# Altium schematic sheet FEV-60_Motor_Driver_Mcu.SchDoc
size B
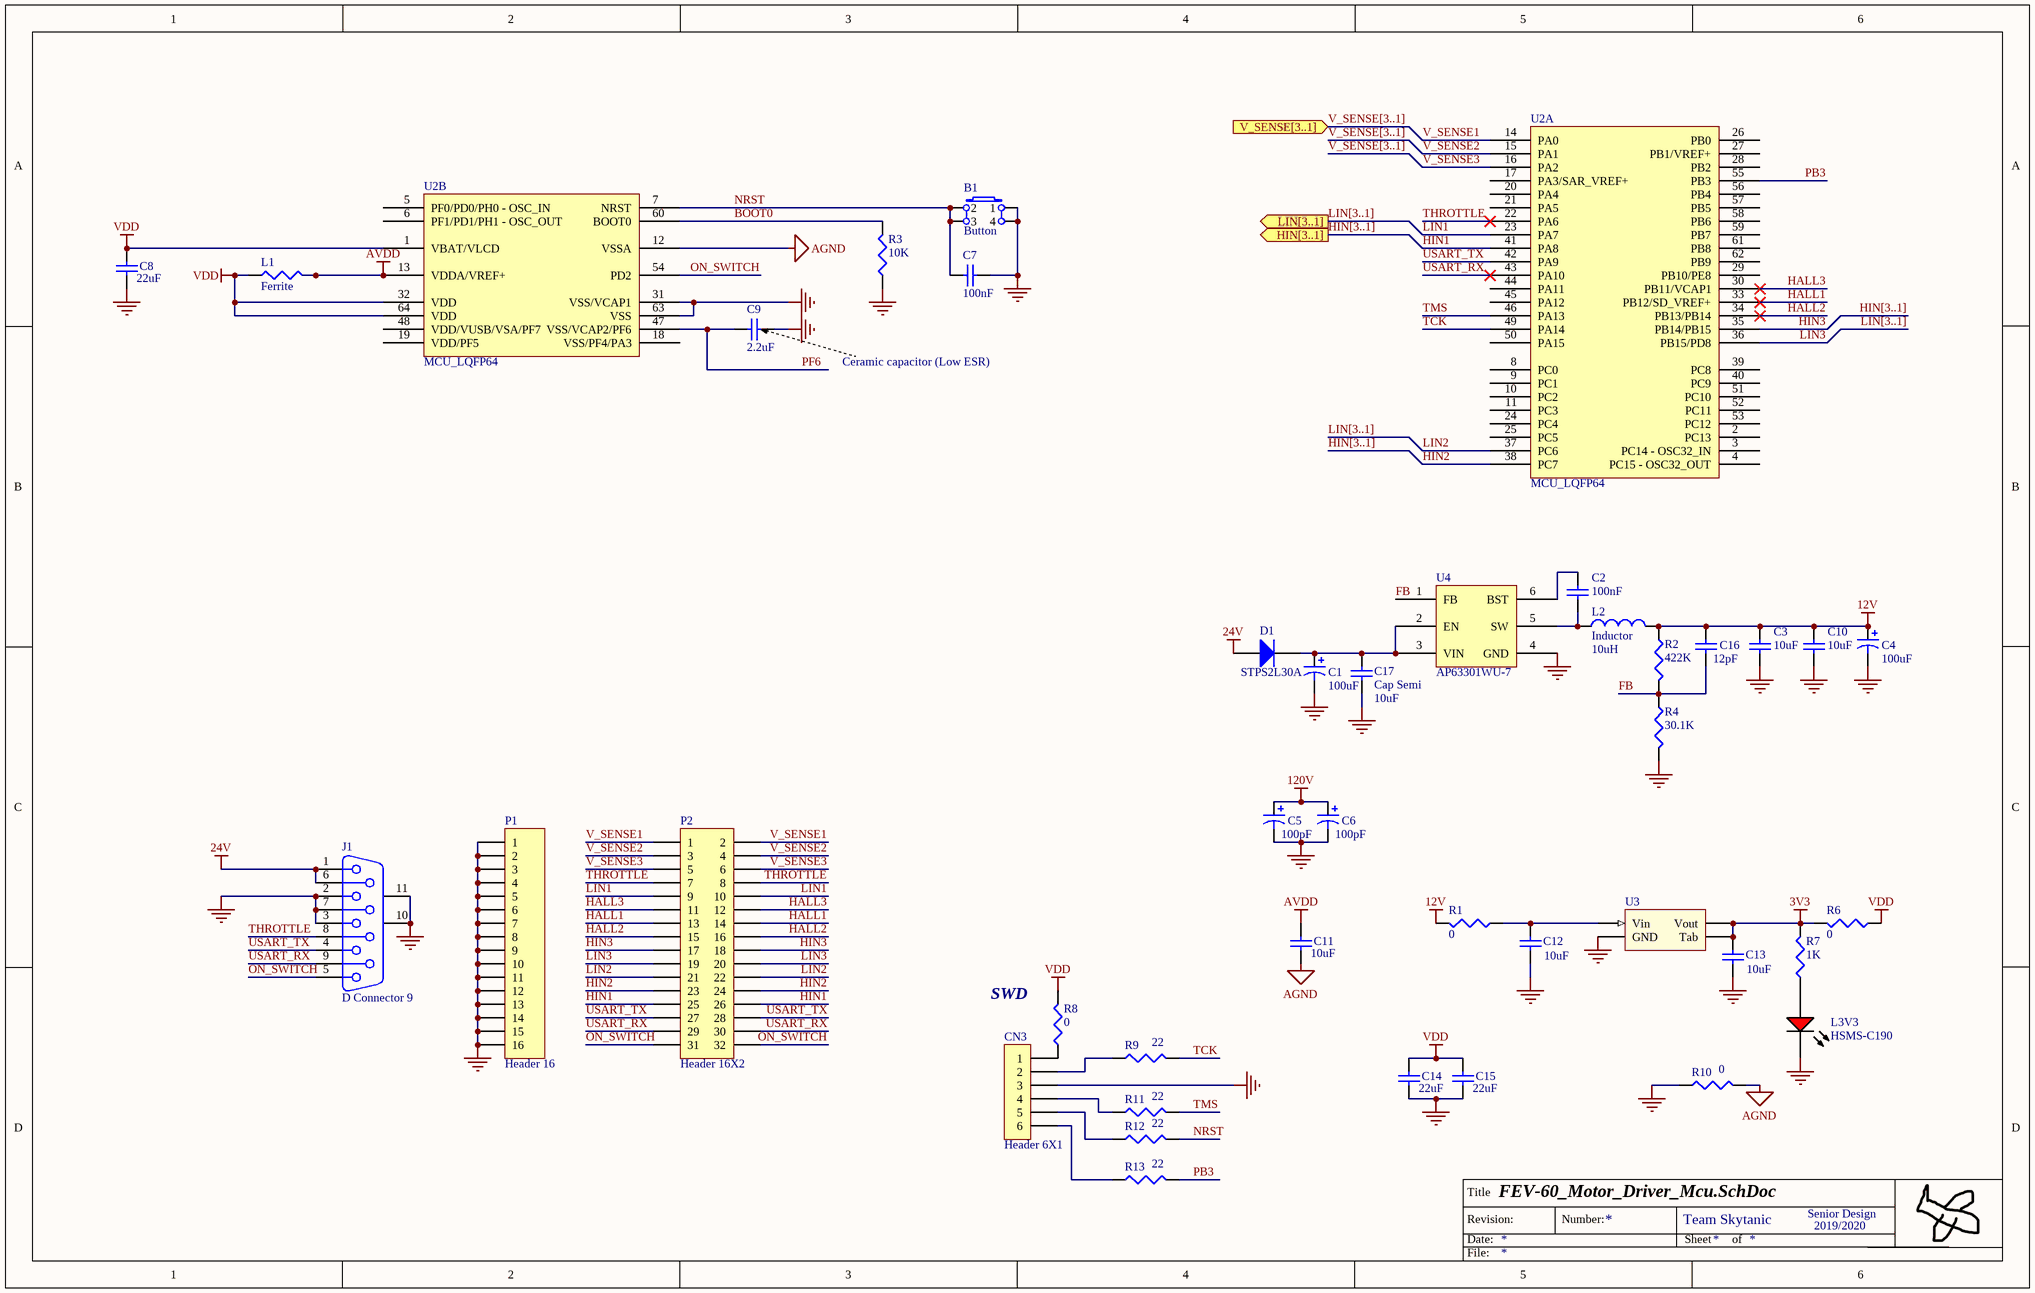
[diagram p0: FEV-60_Motor_Driver_Mcu.SchDoc]

## Parts
B1  Button  [Button - duplicate]
C1  value 100uF  [UVY1V101MED1TD]  (hidden comment: UVY1V101MED1TD)
C2  value 100nF  [1608[0603]]  (hidden comment: Cap Semi)
C3  value 10uF  [1608[0603]]  (hidden comment: Cap Semi)
C4  value 100uF  [UVY1V101MED1TD]  (hidden comment: UVY1V101MED1TD)
C5  value 100pF  [UCS2D151MHD1TN]  (hidden comment: UCS2D151MHD1TN)
C6  value 100pF  [UCS2D151MHD1TN]  (hidden comment: UCS2D151MHD1TN)
C7  value 100nF  [1608[0603]]  (hidden comment: Cap Semi)
C8  value 22uF  [1608[0603]]  (hidden comment: Cap Semi)
C9  value 2.2uF  [1608[0603]]  (hidden comment: Cap Semi)
C10  value 10uF  [1608[0603]]  (hidden comment: Cap Semi)
C11  value 10uF  [1608[0603]]  (hidden comment: Cap Semi)
C12  value 10uF  [1608[0603]]  (hidden comment: Cap Semi)
C13  value 10uF  [1608[0603]]  (hidden comment: Cap Semi)
C14  value 22uF  [1608[0603]]  (hidden comment: Cap Semi)
C15  value 22uF  [1608[0603]]  (hidden comment: Cap Semi)
C16  value 12pF  [1608[0603]]  (hidden comment: Cap Semi)
C17  Cap Semi  value 10uF  [1608[0603]]
CN3  Header 6X1  [HDR1X6]
D1  STPS2L30A  [STPS2L30A]
J1  D Connector 9  [DSUB1.385-2H9]
L1  Ferrite  [J1-0603]
L2  Inductor  value 10uH  [74404084100]
L3V3  HSMS-C190  [AVAG-HSMX-C190_V]
P1  Header 16  [HDR1X16]
P2  Header 16X2  [HDR2X16]
R1  value 0  [J1-0603]  (hidden comment: Res3)
R2  value 422K  [J1-0603]  (hidden comment: Res3)
R3  value 10K  [J1-0603]  (hidden comment: Res3)
R4  value 30.1K  [J1-0603]  (hidden comment: Res3)
R6  value 0  [J1-0603]  (hidden comment: Res3)
R7  value 1K  [J1-0603]  (hidden comment: Res3)
R8  value 0  [J1-0603]  (hidden comment: Res3)
R9  value 22  [J1-0603]  (hidden comment: Res3)
R10  value 0  [J1-0603]  (hidden comment: Res3)
R11  value 22  [J1-0603]  (hidden comment: Res3)
R12  value 22  [J1-0603]  (hidden comment: Res3)
R13  value 22  [J1-0603]  (hidden comment: Res3)
U2  MCU_LQFP64  [STM32F030R8 - duplicate]  (parts A,B of 2)
U3  LD1117S33TR  [LD1117S33TR - duplicate]  (value not drawn)
U4  AP63301WU-7  [AP63301WU-7]

## Ports
HIN[3..1] (out), LIN[3..1] (out), V_SENSE[3..1] (in)

## Nets
3V3: C13.2 R6.2 R7.2 U3.2(Vout) U3.4(Tab)
12V: C3.2 C4.1 C10.2 C16.2 L2.2 R1.2 R2.1
24V: D1.1(A) J1.1 J1.6
120V: C5.1 C6.1
AGND: C11.1 R10.2 U2.12(VSSA)
AVDD: C11.2 L1.2 U2.13(VDDA/VREF+)
GND: B1.1 B1.4 C1.2 C3.1 C4.2 C5.2 C6.2 C7.1 C8.1 C9.1 C10.1 C12.1 C13.1 C14.1 C15.1 C17.1 CN3.3 J1.2 J1.3 J1.7 J1.10(MH1) J1.11(MH2) L3V3.2(K) P1.1 P1.2 P1.3 P1.4 P1.5 P1.6 P1.7 P1.8 P1.9 P1.10 P1.11 P1.12 P1.13 P1.14 P1.15 P1.16 R3.1 R4.2 R10.1 U2.31(VSS/VCAP1) U2.63(VSS) U3.1(GND) U4.4(GND)
VDD: C8.2 C14.2 C15.2 L1.1 R6.1 R8.2 U2.1(VBAT/VLCD) U2.32(VDD) U2.64(VDD)
BOOT0: R3.2 U2.60(BOOT0)
FB: C16.1 R2.2 R4.1 U4.1(FB)
HALL1: P2.13 P2.14 U2.33(PB12/SD_VREF+)
HALL2: P2.15 P2.16 U2.34(PB13/PB14)
HALL3: P2.11 P2.12 U2.30(PB11/VCAP1)
HIN1: P2.25 P2.26 U2.41(PA8)
HIN2: P2.23 P2.24 U2.38(PC7)
HIN3: P2.17 P2.18 U2.35(PB14/PB15)
LIN1: P2.9 P2.10 U2.23(PA7)
LIN2: P2.21 P2.22 U2.37(PC6)
LIN3: P2.19 P2.20 U2.36(PB15/PD8)
NRST: B1.2 B1.3 C7.2 R12.2 U2.7(NRST)
ON_SWITCH: J1.5 P2.31 P2.32 U2.54(PD2)
PB3: R13.2 U2.55(PB3)
PF6: C9.2 U2.47(VSS/VCAP2/PF6)
TCK: R9.2 U2.49(PA14)
THROTTLE: J1.8 P2.7 P2.8 U2.22(PA6)
TMS: R11.2 U2.46(PA13)
USART_RX: J1.9 P2.29 P2.30 U2.43(PA10)
USART_TX: J1.4 P2.27 P2.28 U2.42(PA9)
V_SENSE1: P2.1 P2.2 U2.14(PA0)
V_SENSE2: P2.3 P2.4 U2.15(PA1)
V_SENSE3: P2.5 P2.6 U2.16(PA2)
NetC1_1: C1.1 C17.2 D1.2(K) U4.2(EN) U4.3(VIN)
NetC2_1: C2.1 L2.1 U4.5(SW)
NetC2_2: C2.2 U4.6(BST)
NetC12_2: C12.2 R1.1 U3.3(Vin)
NetCN3_1: CN3.1 R8.1
NetCN3_2: CN3.2 R9.1
NetCN3_4: CN3.4 R11.1
NetCN3_5: CN3.5 R12.1
NetCN3_6: CN3.6 R13.1
NetL3V3_1: L3V3.1(A) R7.1

Not connected (* = marked no-connect by the designer): U2 2(PC13) 3(PC14_-_OSC32_IN) 4(PC15_-_OSC32_OUT) 5(PF0/PD0/PH0_-_OSC_IN) 6(PF1/PD1/PH1_-_OSC_OUT) 8(PC0) 9(PC1) 10(PC2) 11(PC3) 17(PA3/SAR_VREF+) 18(VSS/PF4/PA3) 19(VDD/PF5) 20(PA4) 21(PA5) 24(PC4) 25(PC5) 26(PB0) 27(PB1/VREF+) 28(PB2) 29(PB10/PE8) 39(PC8) 40(PC9) 44(PA11) 45(PA12) 48(VDD/VUSB/VSA/PF7) 50(PA15) 51(PC10) 52(PC11) 53(PC12) 56(PB4) 57(PB5) 58(PB6) 59(PB7) 61(PB8) 62(PB9)

## Buses and harness runs
bus HIN[3..1]
bus HIN[3..1] = port HIN[3..1]
bus LIN[3..1]
bus LIN[3..1] = port LIN[3..1]
bus V_SENSE[3..1]
bus V_SENSE[3..1] = port V_SENSE[3..1]

## Notes on the sheet
- Ceramic capacitor (Low ESR)
- SWD
- Title
- Date:
- Revision:
- Number:
- Team Skytanic
- Sheet
- of
- Senior Design
- 2019/2020
- File:

## Library data of the parts
C1 C4 = UVY1V101MED1TD: Polarized Capacitor (Axial); Published: 8-Jun-2000; LatestRevisionDate: 17-Jul-2002; LatestRevisionNote: Re-released for DXP Platform.; PackageReference: POLAR0.8; Publisher: Altium Limited; PackageDescription: Polarized Capacitor; 2 Leads
C2 C3 C7-C17 = Cap Semi: Capacitor (Semiconductor SIM Model); Published: 8-Jun-2000; LatestRevisionDate: 29-May-2009; LatestRevisionNote: IPC-7351 Footprint Added.; PackageReference: C1206; Publisher: Altium Limited; PackageDescription: Chip Capacitor
C5 C6 = UCS2D151MHD1TN: Polarized Capacitor (Axial); Published: 8-Jun-2000; LatestRevisionDate: 17-Jul-2002; LatestRevisionNote: Re-released for DXP Platform.; PackageReference: POLAR0.8; Publisher: Altium Limited; PackageDescription: Polarized Capacitor; 2 Leads
CN3 = Header 6X1: Header, 6-Pin, Single row; LatestRevisionDate: 17-Jul-2002; LatestRevisionNote: Re-released for DXP Platform.; Publisher: Altium Limited
D1 = STPS2L30A: Manuf_1: STM; Provided: ST; Order: BAT60JFILM; ECCN_US/EU: EAR99/NEC; Revision: July-2002: Re-released for DXP Platform.; Manuf_Part_1: BAT60JFILM; Distrib: ST
J1 = D Connector 9: Receptacle Assembly, 9 Position, Right Angle; PackageDocument: O; Positions: 9; Published: 15-Jun-2001; LatestRevisionDate: 17-Jul-2002; LatestRevisionNote: Re-released for DXP Platform.; DatasheetDocument: 1-Sep-1999; PackageReference: 788750; Publisher: Altium Limited; Orientation: Right Angle; Gender: Receptacle
L1 R1-R4 R6-R13 = Res3: Resistor; Published: 8-Jun-2000; LatestRevisionDate: 29-May-2009; LatestRevisionNote: IPC-7351 Footprint Added.; PackageReference: J1-0603; Publisher: Altium Limited; PackageDescription: Chip Resistor
L2 = Inductor: Code_IEC: 1005; Published: 8-Jun-2000; LatestRevisionDate: 29-May-2009; LatestRevisionNote: IPC-7351 Footprint Added.; PackageReference: 0402-A; Publisher: Altium Limited; PackageDescription: Chip Inductor; Code_JEITA: 0402
L3V3 = CMP-2000-06427-1: LED Uni-Color Red, 52 mW, 20 mA, -40 to 85 degC, 2-Pin SMD, RoHS, Tape and Reel; Manufacturer: Avago; Reverse Voltage: 5V; Viewing Angle: 170deg; High Brightness: No; Lens Type: ColorlessDiffused; DELETED: Compliant; Product Height (mm): 0.8mm; Dominant Wave Length: 626nm; Number of  Elements: 1; Chip Material: GaP; Lum Intensity: 10mcd; Product Length (mm): 1.6mm; Forward Voltage: 2.6V; Power Dissipation: 52W; Shape Type: Rectangular; Forward Current: 25mA; Peak Wavelength: 630nm; Test Current (It): 20mA; Main Category: ChipLED; Lens Dimensions: 1x0.8x0.5mm; Pin Count: 2; Package Reference: HSMX-C190; Mounting Technology: SurfaceMount; Mounting: SurfaceMount; Datasheet URL: http://docs.avagotech.com/docs/AV02-0551EN; Package Type: ChipLed; Operating Temperature Classification: Industrial; Datasheet Version: 03/2012; Operating Temp Range: -40Cto85C; Emitting Color: Red; Rad Hardened: No; Manufacturer URL: http://www.avagotech.com/; Luminous Intensity: 10mcd; Package Description: 2-Pin Surface Mount Device, Body 1.6 x 0.8 mm, Height 0.9 mm; Type: Uni-Color; Packaging: TapeandReel; Product Depth (mm): 0.8mm
P1 = Header 16: Header, 16-Pin; LatestRevisionDate: 17-Jul-2002; LatestRevisionNote: Re-released for DXP Platform.; Publisher: Altium Limited
P2 = Header 16X2: Header, 16-Pin, Dual row; LatestRevisionDate: 17-Jul-2002; LatestRevisionNote: Re-released for DXP Platform.; Publisher: Altium Limited
U4 = AP63301WU-7: Buck Switching Regulator IC Positive Adjustable 0.8V 1 Output 3A SOT-23-6 Thin, TSOT-23-6; ComponentLink1Description: Digikey; ComponentLink1URL: https://www.digikey.com/product-detail/en/diodes-incorporated/AP63301WU-7/31-AP63301WU-7CT-ND/10492238